# EAGLE design Board_v2_Round_Team_2 (EAGLE 8.1.0)
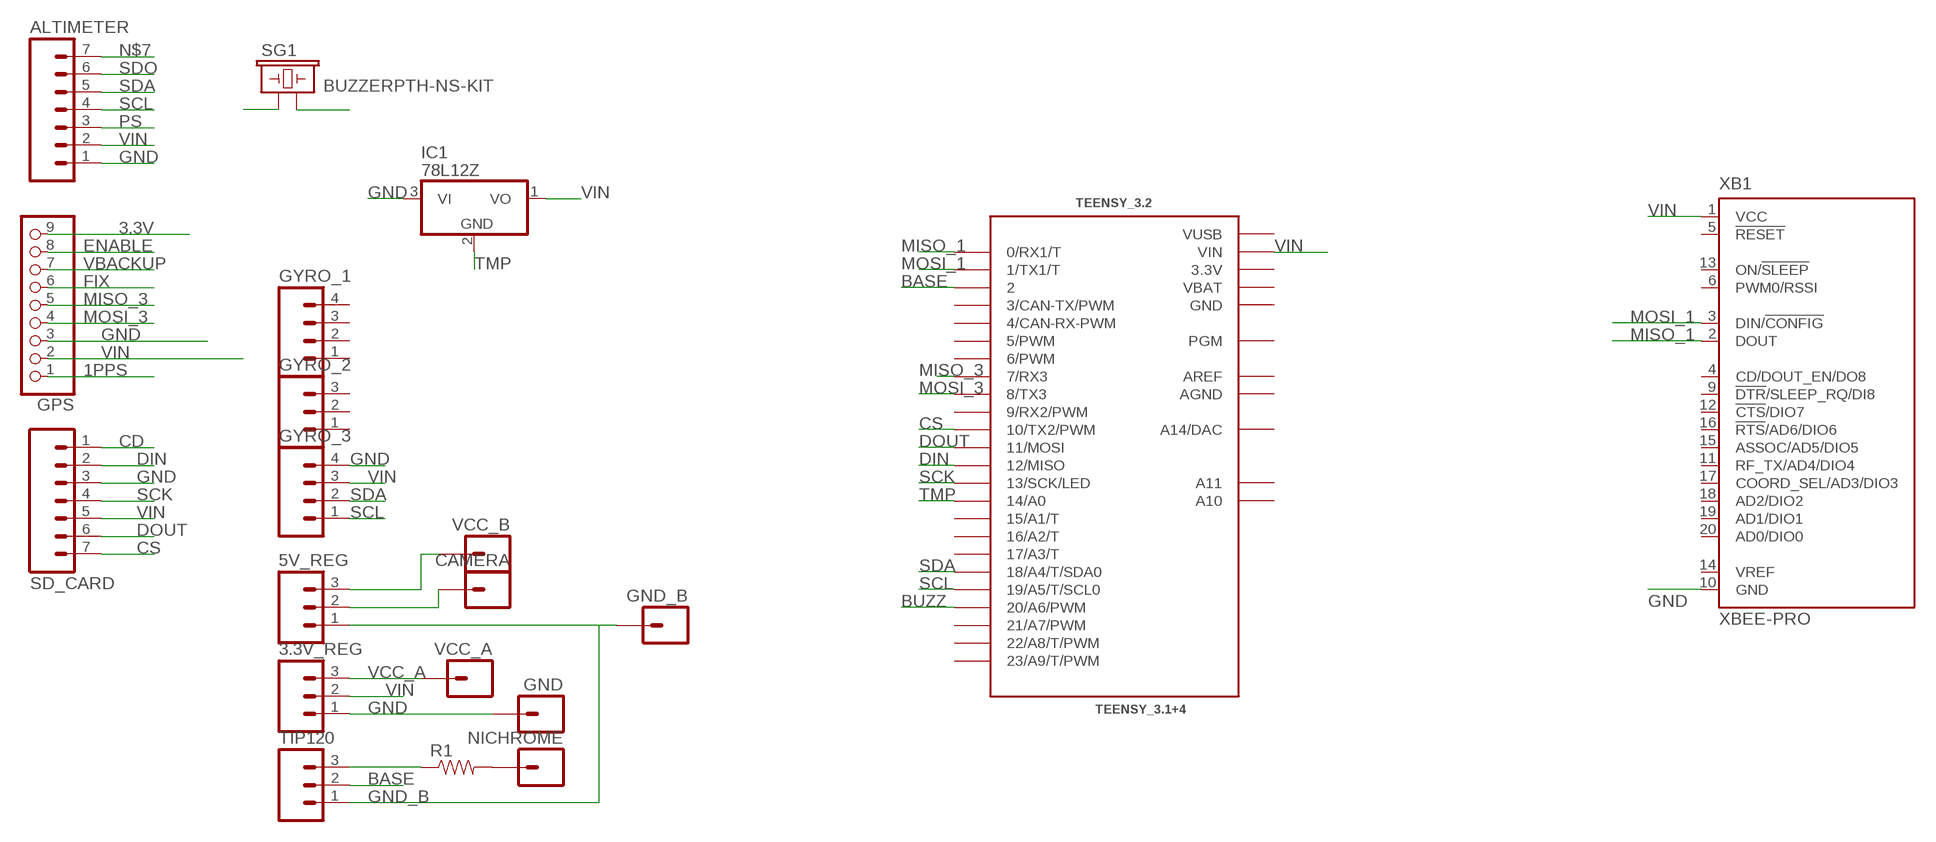
[diagram p0: schematic, sheet 1]

## Parts
3.3V_REG  M03PTH  [1X03]
5V_REG  M03PTH  [1X03]
ALTIMETER  M07  [1X07]
CAMERA  M01NOSILK-KIT  [1X01NS-KIT]
GND  M01PTH_LONGPAD  [1X01_LONGPAD]
GND_B  M01OFFSET  [1X01_OFFSET]
GPS  HEADER-1X970MIL  [1X09_ROUND_70]
GYRO_1  M04PTH  [1X04]
GYRO_2  M03PTH  [1X03]
GYRO_3  M04PTH  [1X04]
IC1  78L12Z  [TO92]
NICHROME  M01OFFSET  [1X01_OFFSET]
R1  RESISTOREZ  [AXIAL-0.3EZ]
SD_CARD  M07  [1X07]
SG1  BUZZERPTH-NS-KIT  [BUZZER-12MM-NS-KIT]
TEENSY_3.2  TEENSY_3.1+4  [TEENSY_3.1+4]
TIP120  M03PTH  [1X03]
VCC_A  M01PTH_LONGPAD  [1X01_LONGPAD]
VCC_B  M01OFFSET  [1X01_OFFSET]
XB1  XBEE-PRO  [XBEE-PRO]

## Nets
1PPS: GPS.1
3.3V: GPS.9
BASE: TEENSY_3.2.2 TIP120.2
BUZZ: SG1.+ TEENSY_3.2.20/A6(20/A6/PWM)
CD: SD_CARD.1
CS: SD_CARD.7 TEENSY_3.2.10(10/TX2/PWM)
DIN: SD_CARD.2 TEENSY_3.2.12(12/MISO)
DOUT: SD_CARD.6 TEENSY_3.2.11(11/MOSI)
ENABLE: GPS.8
FIX: GPS.6
GND: 3.3V_REG.1 ALTIMETER.1 GND.1 GPS.3 GYRO_3.4 IC1.3(VI) SD_CARD.3 SG1.- XB1.10(GND)
GND_B: 5V_REG.1 GND_B.1 TIP120.1
MISO_1: TEENSY_3.2.0(0/RX1/T) XB1.2(DOUT)
MISO_3: GPS.5 TEENSY_3.2.7(7/RX3)
MOSI_1: TEENSY_3.2.1(1/TX1/T) XB1.3(DIN/!CONFIG)
MOSI_3: GPS.4 TEENSY_3.2.8(8/TX3)
N$1: NICHROME.1 R1.P$2
N$2: R1.P$1 TIP120.3
N$4: 5V_REG.2 CAMERA.1
N$5: 5V_REG.3 VCC_B.1
N$7: ALTIMETER.7
PS: ALTIMETER.3
SCK: SD_CARD.4 TEENSY_3.2.13(13/SCK/LED)
SCL: ALTIMETER.4 GYRO_3.1 TEENSY_3.2.19/A5(19/A5/T/SCL0)
SDA: ALTIMETER.5 GYRO_3.2 TEENSY_3.2.18/A4(18/A4/T/SDA0)
SDO: ALTIMETER.6
TMP: IC1.2(GND) TEENSY_3.2.14/A0
VBACKUP: GPS.7
VCC_A: 3.3V_REG.3 VCC_A.1
VIN: 3.3V_REG.2 ALTIMETER.2 GPS.2 GYRO_3.3 IC1.1(VO) SD_CARD.5 TEENSY_3.2.VIN XB1.1(VCC)
Unconnected: GYRO_1.1 GYRO_1.2 GYRO_1.3 GYRO_1.4 GYRO_2.1 GYRO_2.2 GYRO_2.3 TEENSY_3.2.3(3/CAN-TX/PWM) TEENSY_3.2.4(4/CAN-RX-PWM) TEENSY_3.2.5(5/PWM) TEENSY_3.2.6(6/PWM) TEENSY_3.2.9(9/RX2/PWM) TEENSY_3.2.15/A1(15/A1/T) TEENSY_3.2.16/A2(16/A2/T) TEENSY_3.2.17/A3(17/A3/T) TEENSY_3.2.21/A7(21/A7/PWM) TEENSY_3.2.22/A8(22/A8/T/PWM) TEENSY_3.2.23/A9(23/A9/T/PWM) TEENSY_3.2.A10 TEENSY_3.2.A11 TEENSY_3.2.A14(A14/DAC) TEENSY_3.2.PGM XB1.4(CD/DOUT_EN/DO8) XB1.5(!RESET) XB1.6(PWM0/RSSI) XB1.9(!DTR!/SLEEP_RQ/DI8) XB1.11(RF_TX/AD4/DIO4) XB1.12(!CTS!/DIO7) XB1.13(ON/!SLEEP) XB1.14(VREF) XB1.15(ASSOC/AD5/DIO5) XB1.16(!RTS!/AD6/DIO6) XB1.17(COORD_SEL/AD3/DIO3) XB1.18(AD2/DIO2) XB1.19(AD1/DIO1) XB1.20(AD0/DIO0)

## Power pins joined to a net without a drawn wire
3.3V: TEENSY_3.2.3.3V TEENSY_3.2.3.3V1(3.3V)
AGND: TEENSY_3.2.AGND
AREF: TEENSY_3.2.AREF
GND: TEENSY_3.2.GND TEENSY_3.2.GND1(GND)
VBAT: TEENSY_3.2.VBAT
VUSB: TEENSY_3.2.VUSB

## Library data of the parts
3.3V_REG 5V_REG GYRO_2 TIP120 = SparkFun-Connectors:M03: Header 3 Standard 3-pin 0.1" header. Use with straight break away headers (SKU : PRT-00116), right angle break away headers (PRT-00553), swiss pins (PRT-00743), machine pins (PRT-00117), and female headers (PRT-00115). Molex polarized connector foot print use with SKU : PRT-08232 with associated crimp pins and housings.
ALTIMETER SD_CARD = SparkFun-Connectors:M07: Header 7 Standard 7-pin 0.1" header. Use with straight break away headers (SKU : PRT-00116), right angle break away headers (PRT-00553), swiss pins (PRT-00743), machine pins (PRT-00117), and female headers (PRT-00115). NOTES ON THE VARIANTS LOCK and LOCK_LONGPADS... This footprint was designed to help hold the alignment of a through-hole component (i.e. 7-pin header) while soldering it into place. You may notice that each hole has been shifted either up or down by 0.005 of an inch from it's more standard position (which is usually a perfectly straight line). This slight alteration caused the pins (the squares in the middle) to touch the edges of the holes. Because they are alternating, it causes a "brace" to hold the header in place. 0.005 has proven to be the perfect amount of "off-center" position when using our standard breakaway headers. Although looks a little odd when you look at the bare footprint, once you have a header in there, the alteration is very hard to notice. Also, if you push a header all the way into place, it is covered up entirely on the bottom side. This idea of altering the position of holes to aid alignment will be further integrated into the Sparkfun Library for other footprints. It can help hold any component with 3 or more connection pins.
CAMERA GND GND_B VCC_A VCC_B = SparkFun-Connectors:M01: Header 1
GPS = microbuilder:HEADER-1X9: PIN HEADER
GYRO_1 GYRO_3 = SparkFun-Connectors:M04: Header 4 Standard 4-pin 0.1" header. Use with straight break away headers (SKU : PRT-00116), right angle break away headers (PRT-00553), swiss pins (PRT-00743), machine pins (PRT-00117), and female headers (PRT-00115). Molex polarized connector foot print use with SKU : PRT-08231 with associated crimp pins and housings. 1MM SMD Version SKU: PRT-10208; PROD_ID: CONN-09696
IC1 = adafruit:78*: Positive VOLTAGE REGULATOR Added bigger pads to the TO-92 package
NICHROME = SparkFun:M01: Header 1
R1 = SparkFun-Passives:RESISTOR: Resistor Basic schematic elements and footprints for 0603, 1206, and PTH resistors.
SG1 = SparkFun:BUZZER: Buzzer 12mm Spark Fun Electronics SKU : Comp-Buzzer
TEENSY_3.2 = Teensy_3_Series_Board_v1.0:TEENSY_3.1+4: Footprint for Teensy 3.1 board using all through-holes, i.e. the entire perimeter plus the 4 through-holes inboard (A10,A11,AREF, VUSB)
XB1 = maxstream:XBEE: XBee (TM) /XBee-PRO(TM) OEM RF Modules Source: MaxStream, Inc. xbee_productmanual.pdf; MPN: XBP24-AWI-001; OC_FARNELL: 1337916; OC_NEWARK: 42M2667

## Board
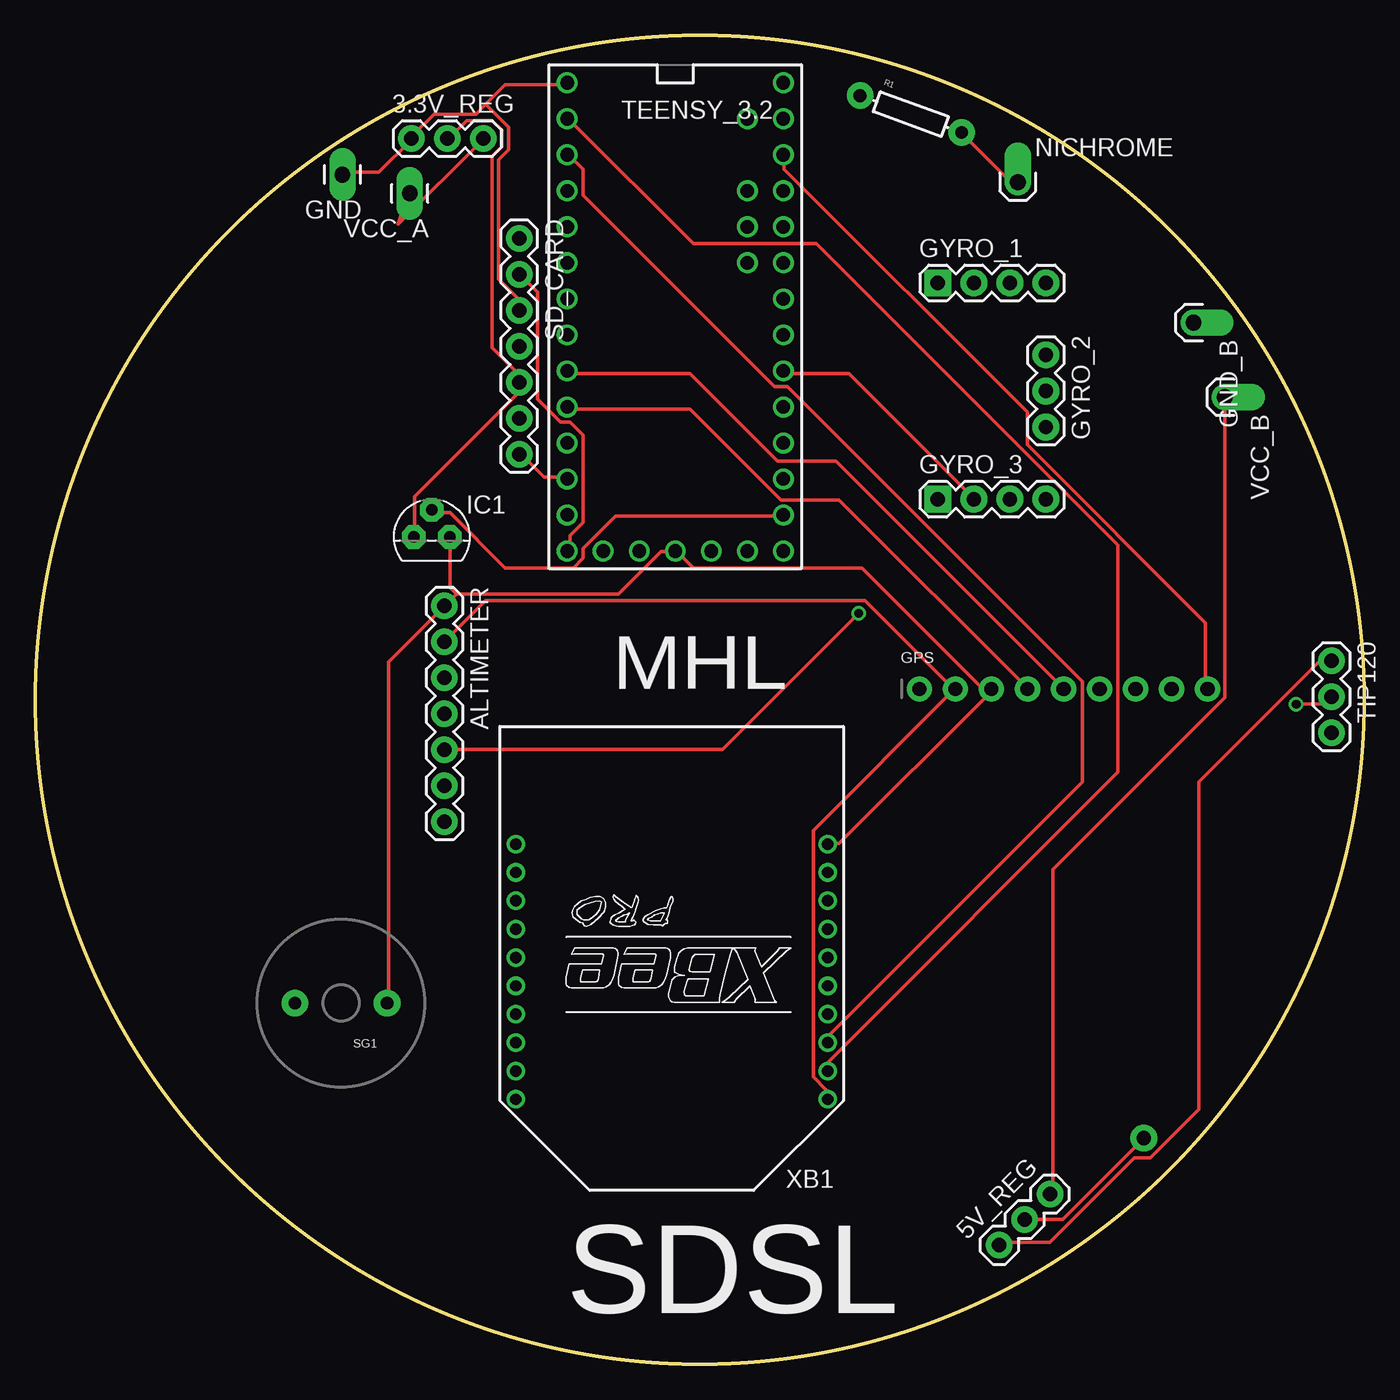
[diagram p1: board, top side]
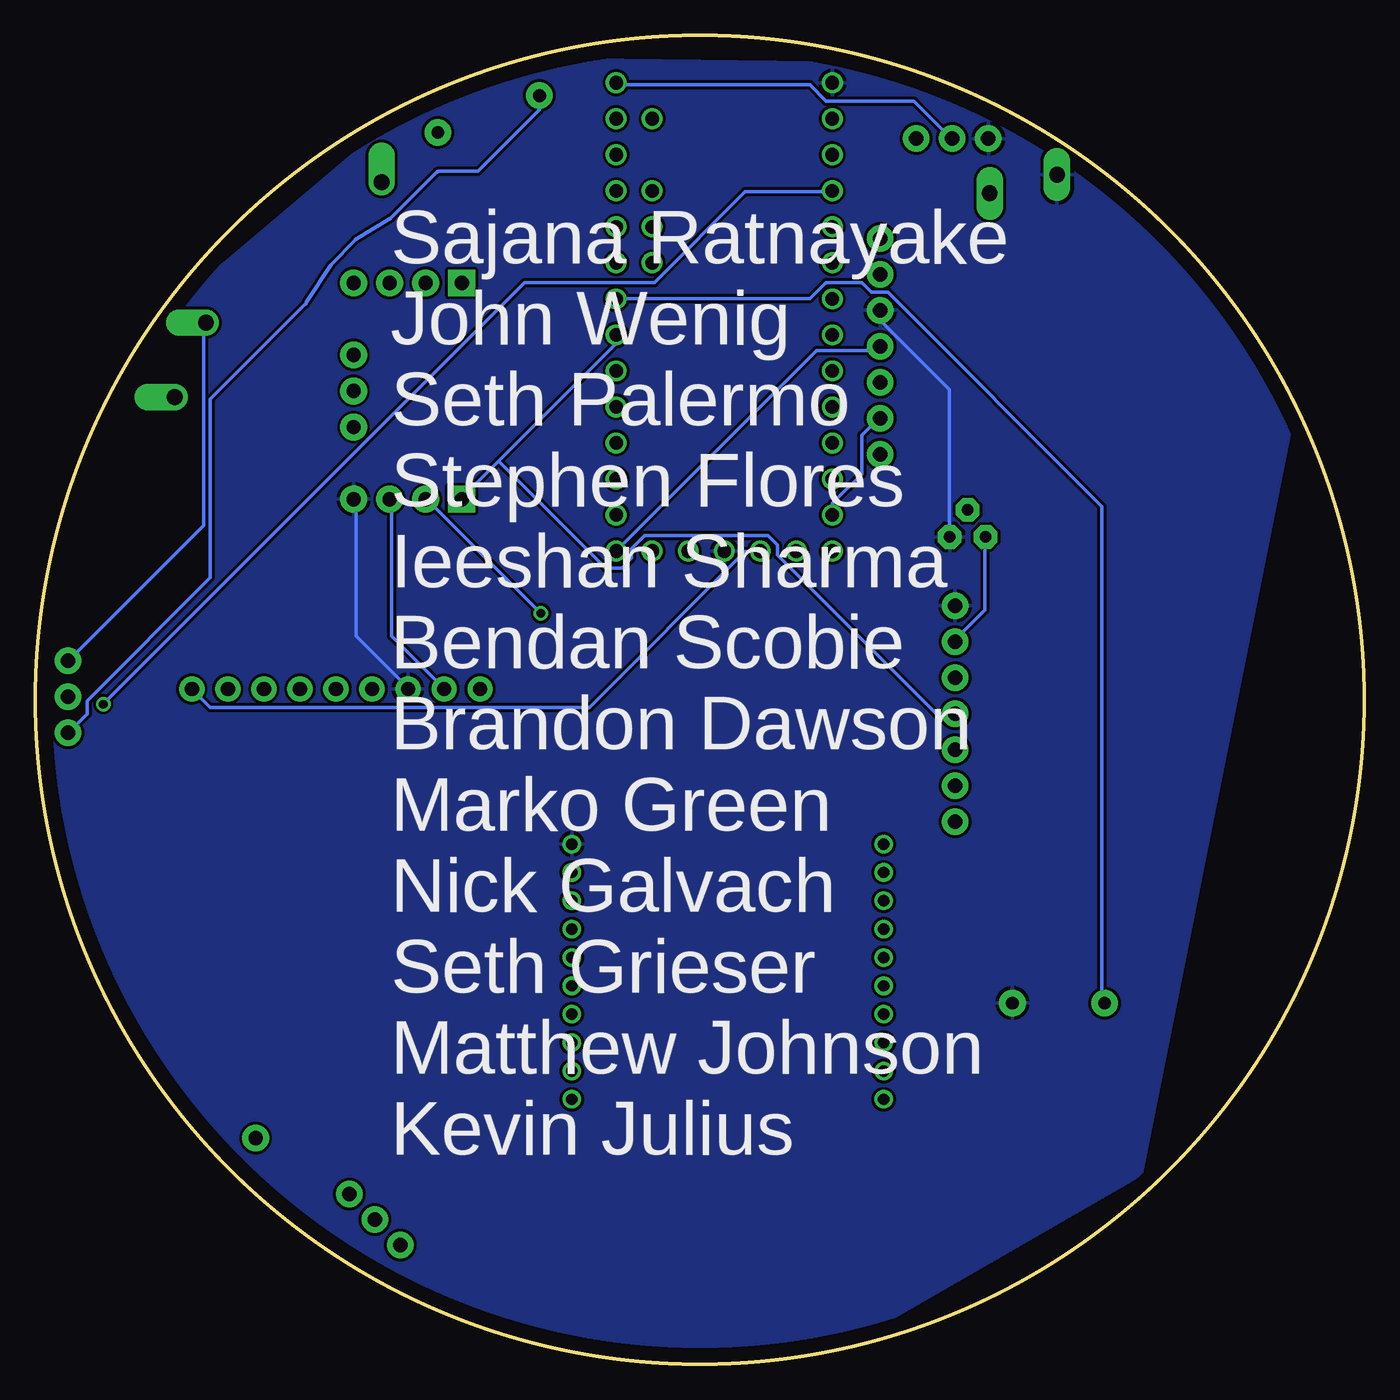
[diagram p2: board, bottom side, seen from below]

Size 93.69 x 93.69 mm. Coordinates in mm from the lower left corner, seen from the top.
Outline: circle at 46.84,46.84 radius 46.84
Copper layers (1*16): Top 0.035mm / dielectric 1.5mm / Bottom 0.035mm
Design rules "default": minimum track width 10mil, minimum drill 24mil, track to track 8mil, track to pad 8mil, pad to pad 8mil, via to via 8mil, smd to smd 8mil, copper to edge 40mil, drill to drill 8mil, minimum pad ring 10mil, minimum via ring 8mil, stop-mask expansion 4mil, vias tented up to drill 0mil, thermal gap 10mil

### Footprints (pad centres in the part's own frame; a part is rotated, then mirrored left to right if it is on the bottom)
1X03 = drill 1.016 pad 1.88: 1 0,0; 2 2.54,0; 3 5.08,0
1X07 = drill 1.016 pad 1.88: 1 0,0; 2 2.54,0; 3 5.08,0; 4 7.62,0; 5 10.16,0; 6 12.7,0; 7 15.24,0
1X01NS-KIT = drill 1.016 pad 1.88: 1 0,0
1X01_LONGPAD = drill 1.118 pad 1.88 long: 1 0,0
1X01_OFFSET = drill 1.118 pad 1.88 offset: 1 0,0
1X09_ROUND_70 = drill 1 pad 1.778: 1 -10.16,0; 2 -7.62,0; 3 -5.08,0; 4 -2.54,0; 5 0,0; 6 2.54,0; 7 5.08,0; 8 7.62,0; 9 10.16,0
1X04 = drill 1.016 pad 1.88 square: 1 0,0 | drill 1.016 pad 1.88: 2 2.54,0; 3 5.08,0; 4 7.62,0
TO92 = drill 0.813 pad 1.676 octagon: 1 -1.27,0; 2 0,1.905; 3 1.27,0
AXIAL-0.3EZ = drill 0.9 pad 1.88: P$1 -3.81,0; P$2 3.81,0
BUZZER-12MM-NS-KIT = drill 0.9 pad 1.88: + 3.25,0; - -3.25,0
TEENSY_3.1+4 = drill 0.965: 0 -7.62,15.24; 1 -7.62,12.7; 2 -7.62,10.16; 3 -7.62,7.62; 3.3V 7.62,12.7; 3.3V1 -2.54,-15.24; 4 -7.62,5.08; 5 -7.62,2.54; 6 -7.62,0; 7 -7.62,-2.54; 8 -7.62,-5.08; 9 -7.62,-7.62; 10 -7.62,-10.16; 11 -7.62,-12.7; 12 -7.62,-15.24; 13 7.62,-15.24; 14/A0 7.62,-12.7; 15/A1 7.62,-10.16; 16/A2 7.62,-7.62; 17/A3 7.62,-5.08; 18/A4 7.62,-2.54; 19/A5 7.62,0; 20/A6 7.62,2.54; 21/A7 7.62,5.08; 22/A8 7.62,7.62; 23/A9 7.62,10.16; A10 5.08,7.62; A11 5.08,5.08; A14 5.08,-15.24; AGND 7.62,15.24; AREF 5.08,10.16; GND -7.62,17.78; GND1 0,-15.24; PGM 2.54,-15.24; VBAT -5.08,-15.24; VIN 7.62,17.78; VUSB 5.08,15.24
XBEE-PRO = drill 0.8 pad 1.27: 1 -11,9; 2 -11,7; 3 -11,5; 4 -11,3; 5 -11,1; 6 -11,-1; 7 -11,-3; 8 -11,-5; 9 -11,-7; 10 -11,-9; 11 11,-9; 12 11,-7; 13 11,-5; 14 11,-3; 15 11,-1; 16 11,1; 17 11,3; 18 11,5; 19 11,7; 20 11,9

### Placement (x,y rotation side)
3.3V_REG  26.5,86.42 0 top
5V_REG  67.95,8.39 45 top
ALTIMETER  28.84,53.47 270 top
CAMERA  78.16,15.93 0 top
GND  21.65,83.88 180 top
GND_B  81.67,73.44 270 top
GPS  72.5,47.61 0 top
GYRO_1  63.63,76.23 0 top
GYRO_2  71.25,71.15 270 top
GYRO_3  63.63,60.99 0 top
IC1  27.95,58.32 0 top
NICHROME  69.27,83.34 0 top
R1  61.73,88.14 340 top
SD_CARD  34.12,79.38 270 top
SG1  21.55,25.46 180 top
TEENSY_3.2  45.12,72.57 0 top
TIP120  91.4,49.59 270 top
VCC_A  26.4,82.56 180 top
VCC_B  83.88,68.18 270 top
XB1  44.86,27.67 180 top

### Tracks (layer width: path | path; a pad name or v marks a point on that pad's centre or on a via)
3.3V
  Top 0.254: TEENSY_3.2.3.3V 52.79,85.17 52.79,84.26 69.93,67.11 69.93,64.83 82.51,52.25 82.51,47.68 GPS.9
  Bottom 0.254: GPS.9 81.36,46.31 54.62,46.31 43.64,57.28 42.73,57.28 TEENSY_3.2.3.3V1
BASE  (via drill 0.61)
  Top 0.254: v88.91,46.54 90.74,46.54 91.19,47 TIP120.2
  Bottom 0.254: v88.91,46.54 59.19,76.26 50.04,76.26 43.64,82.66 37.7,82.66 TEENSY_3.2.2
BUZZ
  Bottom 0.254: TEENSY_3.2.20/A6 39.07,75.11 37.93,76.26 35.41,76.26 34.73,75.57 33.59,75.57 18.5,60.48 18.5,25.51 SG1.+
CS
  Top 0.254: TEENSY_3.2.10 37.47,62.54 35.87,62.54 34.27,64.14 SD_CARD.7
DIN
  Top 0.254: TEENSY_3.2.12 37.7,57.51 37.7,58.43 38.61,59.34 38.61,65.51 37.7,66.43 37.01,66.43 35.41,68.03 35.41,75.57 34.27,76.71 SD_CARD.2
DOUT
  Bottom 0.254: TEENSY_3.2.11 37.47,60.03 37.47,60.71 35.41,62.77 35.41,65.51 34.27,66.66 SD_CARD.6
GND
  Top 0.254: 67.19,47.23 67.42,47.45 GPS.3 67.19,47.23 | 67.19,47.23 56.67,36.71 55.99,36.71 XB1.10 | 31.76,88.83 31.07,88.14 28.1,88.14 26.5,86.54 3.3V_REG.1 26.5,86.32 24.21,84.03 21.7,84.03 GND.1 | 31.76,88.83 33.13,90.2 37.47,90.2 TEENSY_3.2.GND | 31.76,88.83 33.36,87.23 33.36,85.63 32.67,84.94 32.67,76.49 34.04,75.11 34.04,74.43 SD_CARD.3 | 29.7,54.31 41.13,54.31 44.1,57.28 45.02,57.28 TEENSY_3.2.GND1 45.24,57.28 46.39,56.14 58.27,56.14 67.19,47.23 | 29.7,54.31 29.01,53.63 ALTIMETER.1 28.79,53.4 24.9,49.51 24.9,25.51 SG1.- | 29.7,54.31 29.24,54.77 29.24,58.2 IC1.3
  Bottom 0.254: GYRO_3.4 71.08,60.94 71.08,51.34 67.42,47.68 GPS.3 | SD_CARD.3 34.04,74.2 34.04,73.51 29.24,68.71 29.24,58.43 IC1.3
  pour Bottom: 46.51,0.03 52.81,0.39 57.51,1.3 66.15,4.07 70.44,6.51 75.83,10.42 83.24,17.58 90.71,30.97 93.2,43.42 92.54,54.24 86.32,70.92 84.69,74.43 80.09,77.96 67.72,88.42 54.97,92.08 36,91.85 24.37,87.61 21.37,86.14 18.8,83.88 15.22,81.11 9.86,75.09 5.16,65.74 15.65,13.27 34.4,2.5 36.38,2.04
GND_B
  Top 0.254: 5V_REG.1 68.1,8.59 71.53,8.59 77.48,14.54 78.62,14.54 82.05,17.96 82.05,41.05 90.51,49.51 91.19,49.51 TIP120.1
  Bottom 0.254: GND_B.1 81.82,73.29 81.82,59.11 91.19,49.74 TIP120.1
MISO_1
  Top 0.254: XB1.2 55.99,20.71 55.99,21.39 76.33,41.74 76.33,57.74 55.07,79 46.39,79 37.7,87.69 TEENSY_3.2.0
MISO_3
  Top 0.254: TEENSY_3.2.7 37.7,69.86 46.16,69.86 52.33,63.68 56.45,63.68 72.45,47.68 GPS.5
MOSI_1
  Top 0.254: XB1.3 55.99,22.76 55.99,23.22 73.82,41.05 73.82,48.14 53.02,68.94 52.1,68.94 38.61,82.43 38.61,84.26 37.7,85.17 TEENSY_3.2.1
MOSI_3
  Top 0.254: TEENSY_3.2.8 37.7,67.34 46.16,67.34 52.56,60.94 56.67,60.94 69.93,47.68 GPS.4
N$1
  Top 0.254: NICHROME.1 68.79,83.34 65.36,86.77 R1.P$2
N$2
  Bottom 0.254: TIP120.3 90.05,45.85 90.05,46.77 81.36,55.45 81.36,68.03 74.66,74.74 arc-45 74.58,74.91 72.85,77.53 71.1,79.28 arc45 71.15,79.28 68.64,80.8 65.41,84.03 arc45 65.23,84.11 62.49,84.11 58.22,88.37 arc-45 58.15,88.55 R1.P$1 58.27,89.29
N$4
  Top 0.254: 5V_REG.2 69.93,10.19 72.45,10.19 78.16,15.91 CAMERA.1
N$5
  Top 0.254: VCC_B.1 83.88,47 71.76,34.88 71.76,12.02 5V_REG.3
SCK
  Bottom 0.254: TEENSY_3.2.13 38.61,71.46 34.5,71.46 34.27,71.69 SD_CARD.4
SCL
  Bottom 0.254: 61.02,63.68 63.53,61.17 GYRO_3.1 | 61.02,63.68 52.79,71.91 52.79,72.37 TEENSY_3.2.19/A5 | ALTIMETER.4 30.16,45.85 41.36,57.05 41.36,57.74 42.04,58.43 50.73,58.43 51.65,57.51 51.65,56.83 52.33,56.14 53.47,56.14 61.02,63.68
SDA  (via drill 0.61)
  Top 0.254: TEENSY_3.2.18/A4 52.79,69.86 57.36,69.86 66.05,61.17 GYRO_3.2 | v58.05,52.94 48.44,43.34 29.01,43.34 ALTIMETER.5
  Bottom 0.254: v58.05,52.94 66.05,60.94 GYRO_3.2
TMP
  Top 0.254: TEENSY_3.2.14/A0 52.56,59.8 40.9,59.8 38.61,57.51 38.61,56.83 37.93,56.14 33.13,56.14 29.24,60.03 28.1,60.03 IC1.2
VCC_A  (1 unrouted)
  Top 0.254: VCC_A.1 26.25,82.43 25.58,80.37 31.53,86.32 3.3V_REG.3
VIN
  Top 0.254: XB1.1 55.76,18.88 55.76,19.34 54.85,20.25 54.85,37.62 64.68,47.45 GPS.2 64.68,47.68 58.5,53.85 31.76,53.85 ALTIMETER.2 | IC1.1 26.73,58.43 26.73,61.17 34.04,68.48 34.04,69.17 SD_CARD.5 34.04,69.4 34.04,69.86 32.21,71.69 32.21,85.17 32.9,85.86 32.9,87 32.21,87.69 30.39,87.69 29.24,86.54 3.3V_REG.2
  Bottom 0.254: GYRO_3.3 68.56,60.94 68.56,51.34 64.9,47.68 GPS.2 | IC1.1 26.73,58.2 26.73,53.17 28.79,51.11 ALTIMETER.2 | TEENSY_3.2.VIN 52.56,90.2 39.07,90.2 37.93,89.06 31.76,89.06 29.24,86.54 3.3V_REG.2

### Text on the board
Measures: All units in inch | All units in inch
_tsilk: MHL | SDSL
_bsilk: Sajana Ratnayake / John Wenig / Seth Palermo / Stephen Flores / Ieeshan Sharma / Bendan Scobie / Brandon Dawson / Marko Green / Nick Galvach / Seth Grieser / Matthew Johnson / Kevin Julius